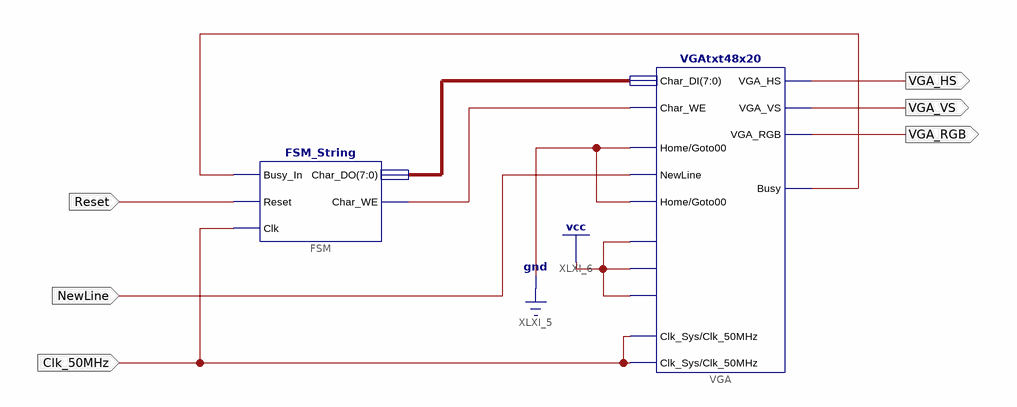
[diagram p0: schematic sheet 1]
// Xilinx ISE schematic Top_HelloOnVGA.sch (spartan3e) as structural Verilog: 2 symbols, 6 ports
module Top_HelloOnVGA (
  input  Clk_50MHz,
  input  Reset,
  input  NewLine,
  output VGA_HS,
  output VGA_VS,
  output VGA_RGB
);

  wire XLXN_12, XLXN_18;
  wire [7:0] XLXN_16;

  VGAtxt48x20 VGA (
    .Char_DI(XLXN_16), .Home(1'b0), .NewLine(NewLine), .Goto00(1'b0), .Clk_Sys(Clk_50MHz),
    .Clk_50MHz(Clk_50MHz), .CursorOn(1'b1), .ScrollEn(1'b1), .ScrollClear(1'b1), .Busy(XLXN_12),
    .VGA_HS(VGA_HS), .VGA_VS(VGA_VS), .VGA_RGB(VGA_RGB), .Char_WE(XLXN_18));
  FSM_String FSM (.Reset(Reset), .Busy_In(XLXN_12), .Clk(Clk_50MHz), .Char_DO(XLXN_16), .Char_WE(XLXN_18));
endmodule
